# Altium project altium_v4.PrjPCB (part 2 of 2)

## Sheet Communications.SchDoc
size A
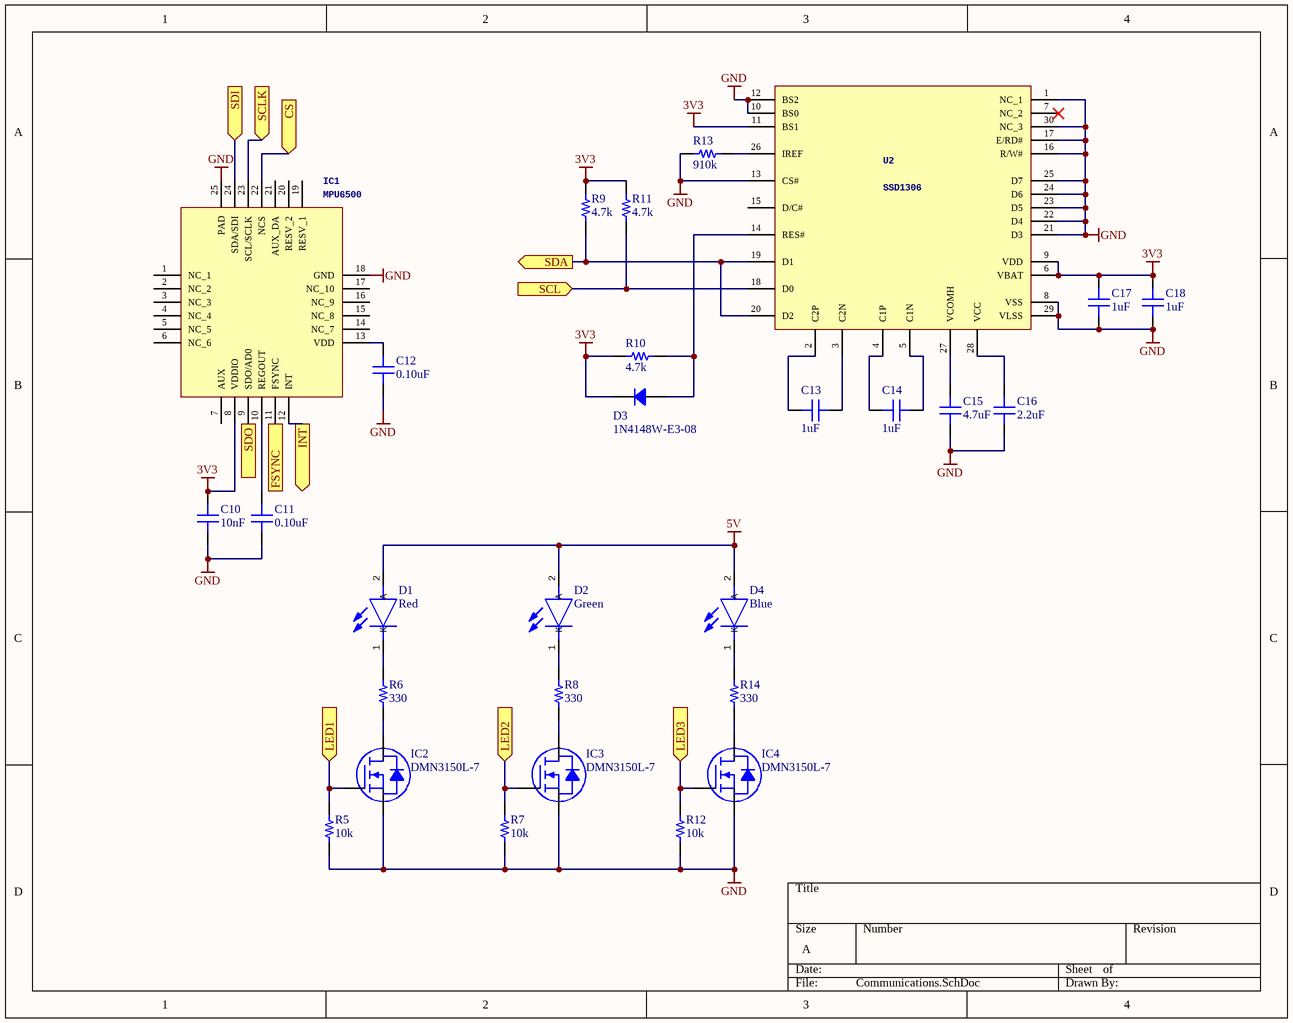
[diagram p5: Communications.SchDoc]

### Parts
C10  10nF  [CAP 0402/1005]
C11  0.10uF  [CAP 0402/1005]
C12  0.10uF  [CAP 0402/1005]
C13  1uF  [CAP 0603/1608]
C14  1uF  [CAP 0603/1608]
C15  4.7uF  [CAP 0805/2012]
C16  2.2uF  [CAP 0402/1005]
C17  1uF  [CAP 0603/1608]
C18  1uF  [CAP 0603/1608]
D1  Red  [LTST]
D2  Green  [LTST]
D3  1N4148W-E3-08  [SOD-123]
D4  Blue  [LTST]
IC1  MPU6500  [QFN40P300X300X95-25N]
IC2  DMN3150L-7  [DIODES SOT-23-3]
IC3  DMN3150L-7  [DIODES SOT-23-3]
IC4  DMN3150L-7  [DIODES SOT-23-3]
R5  10k  [RES 0402/1005]
R6  330  [RES 0402/1005]
R7  10k  [RES 0402/1005]
R8  330  [RES 0402/1005]
R9  4.7k  [RES 0603/1608]
R10  4.7k  [RES 0603/1608]
R11  4.7k  [RES 0603/1608]
R12  10k  [RES 0402/1005]
R13  910k  [RES 0402/1005]
R14  330  [RES 0402/1005]
U2  SSD1306  [30PINFPC_P0.7MM]

### Ports
CS (in), FSYNC (in), INT (out), LED1 (in), LED2 (in), LED3 (in), SCL (in), SCLK (in), SDA (out), SDI (in), SDO (out)

### Nets
3V3: C10.2 C17.2 C18.2 D3.2 IC1.8(VDDIO) R9.2 R10.2 R11.2 U2.6(VBAT) U2.9(VDD) U2.11(BS1)
5V: D1.2(A) D2.2(A) D4.2(A)
GND: C10.1 C11.1 C12.1 C15.1 C16.1 C17.1 C18.1 IC1.18(GND) IC1.25(PAD) IC2.3(S) IC3.3(S) IC4.3(S) R5.1 R7.1 R12.1 R13.1 U2.1(NC_1) U2.8(VSS) U2.10(BS0) U2.12(BS2) U2.13(CS#) U2.16(R/W#) U2.17(E/RD#) U2.21(D3) U2.22(D4) U2.23(D5) U2.24(D6) U2.25(D7) U2.29(VLSS) U2.30(NC_3)
NetC11_2: C11.2 IC1.10(REGOUT)
NetC12_2: C12.2 IC1.13(VDD)
NetC13_1: C13.1 U2.2(C2P)
NetC13_2: C13.2 U2.3(C2N)
NetC14_1: C14.1 U2.4(C1P)
NetC14_2: C14.2 U2.5(C1N)
NetC15_2: C15.2 U2.27(VCOMH)
NetC16_2: C16.2 U2.28(VCC)
NetD1_1: D1.1(K) R6.2
NetD2_1: D2.1(K) R8.2
NetD3_1: D3.1 R10.1 U2.14(RES#)
NetD4_1: D4.1(K) R14.2
NetIC1_9: IC1.9(SDO/AD0) ; port SDO
NetIC1_11: IC1.11(FSYNC) ; port FSYNC
NetIC1_12: IC1.12(INT) ; port INT
NetIC1_22: IC1.22(NCS) ; port CS
NetIC1_23: IC1.23(SCL/SCLK) ; port SCLK
NetIC1_24: IC1.24(SDA/SDI) ; port SDI
NetIC2_1: IC2.1(G) R5.2 ; port LED1
NetIC2_2: IC2.2(D) R6.1
NetIC3_1: IC3.1(G) R7.2 ; port LED2
NetIC3_2: IC3.2(D) R8.1
NetIC4_1: IC4.1(G) R12.2 ; port LED3
NetIC4_2: IC4.2(D) R14.1
NetR9_1: R9.1 U2.19(D1) U2.20(D2) ; port SDA
NetR11_1: R11.1 U2.18(D0) ; port SCL
NetR13_2: R13.2 U2.26(IREF)

Not connected (* = marked no-connect by the designer): IC1 1(NC_1) 2(NC_2) 3(NC_3) 4(NC_4) 5(NC_5) 6(NC_6) 7(AUX) 14(NC_7) 15(NC_8) 16(NC_9) 17(NC_10) 19(RESV_1) 20(RESV_2) 21(AUX_DA); U2 7(NC_2)* 15(D/C#)

### Library data of the parts
C10 = CL05B103KO5NNNC: CAP CER 10000PF 16V X7R 0402; Manufacturer: Samsung Electro-Mechanics America, Inc.; TemperatureRange: -55C ~ 125C; Tolerance: 10%; Value: 10nF; Part Number: CL05B103KO5NNNC; PartId: 12520; Supplier 1: Digi-Key; Supplier Part Number 1: 1276-1051-2-ND; ComponentLink1Description: Datasheet; ComponentLink1URL: http://www.samsungsem.com/kr/support/library/product-catalog/__icsFiles/afieldfile/2015/11/18/MLCC.pdf; ComponentLink2Description: Digi-Key Listing; ComponentLink2URL: https://www.digikey.com/product-detail/en/samsung-electro-mechanics-america-inc/CL05B103KO5NNNC/1276-1051-2-ND/3886709; TemperatureCoefficient: X7R; Voltage: 16V; Price: 0.0017; Device Package: 0402 (1005 Metric)
C11 C12 = GCM155R71C104KA55D: CAP CER 0.1UF 16V X7R 0402; Manufacturer: Murata Electronics North America; TemperatureRange: -55C ~ 125C; Tolerance: 10%; Value: 0.10uF; Part Number: GCM155R71C104KA55D; PartId: 12362; Supplier 1: Digi-Key; Supplier Part Number 1: 490-4759-2-ND; ComponentLink1Description: Datasheet; ComponentLink1URL: http://www.murata.com/~/media/webrenewal/support/library/catalog/products/capacitor/mlcc/c03e.ashx; ComponentLink2Description: Digi-Key Listing; ComponentLink2URL: https://www.digikey.com/product-detail/en/murata-electronics-north-america/GCM155R71C104KA55D/490-4759-2-ND/1641633; TemperatureCoefficient: X7R; Voltage: 16V; Price: 0.0088; Device Package: 0402 (1005 Metric)
C13 C14 C17 C18 = CL10F105ZP8NNNC: CAP CER 1UF 10V Y5V 0603; Manufacturer: Samsung Electro-Mechanics America, Inc.; TemperatureRange: -30C ~ 85C; TemperatureCoefficient: Y5V (F); Tolerance: -20%, +80%; Value: 1uF; Part Number: CL10F105ZP8NNNC; PartId: 13159; Supplier 1: Digi-Key; Supplier Part Number 1: 1276-1041-2-ND; ComponentLink1Description: Datasheet; ComponentLink1URL: http://www.samsungsem.com/kr/support/product-search/mlcc/CL10F105ZP8NNNC.jsp; ComponentLink2Description: Digi-Key Listing; ComponentLink2URL: https://www.digikey.com/product-detail/en/samsung-electro-mechanics-america-inc/CL10F105ZP8NNNC/1276-1041-2-ND/3886699; Voltage: 10V; Price: 0.006; Device Package: 0603 (1608 Metric)
C15 = CC0805ZRY5V6BB475: CAP CER 4.7UF 10V Y5V 0805; Manufacturer: Yageo; TemperatureRange: -30C ~ 85C; TemperatureCoefficient: Y5V (F); Tolerance: -20%, +80%; Value: 4.7uF; Part Number: CC0805ZRY5V6BB475; PartId: 13806; Supplier 1: Digi-Key; Supplier Part Number 1: 311-1371-2-ND; ComponentLink1Description: Datasheet; ComponentLink1URL: http://www.yageo.com/documents/recent/UPY-GPHC_Y5V_6.3V-to-50V_6.pdf; ComponentLink2Description: Digi-Key Listing; ComponentLink2URL: https://www.digikey.com/product-detail/en/yageo/CC0805ZRY5V6BB475/311-1371-2-ND/2103109; Voltage: 10V; Price: 0.0145; Device Package: 0805 (2012 Metric)
C16 = CL05A225KP5NSNC: CAP CER 2.2UF 10V X5R 0402; Manufacturer: Samsung Electro-Mechanics America, Inc.; TemperatureRange: -55C ~ 85C; Tolerance: 10%; Value: 2.2uF; Part Number: CL05A225KP5NSNC; PartId: 12898; Supplier 1: Digi-Key; Supplier Part Number 1: 1276-1108-2-ND; ComponentLink1Description: Datasheet; ComponentLink1URL: http://www.samsungsem.com/kr/support/product-search/mlcc/CL05A225KP5NSNC.jsp; ComponentLink2Description: Digi-Key Listing; ComponentLink2URL: https://www.digikey.com/product-detail/en/samsung-electro-mechanics-america-inc/CL05A225KP5NSNC/1276-1108-2-ND/3886766; TemperatureCoefficient: X5R; Voltage: 10V; Price: 0.0612; Device Package: 0402 (1005 Metric)
D1 D2 D4 = GENERIC_LED: pin to pad: 1>K 2>A
D3 = 1N4148W-E3-08: DIODE GEN PURP 75V 150MA SOD123; Manufacturer: Vishay Semiconductor Diodes Division; Type: Standard; Current Reverse Leakage @ Vr: 100uA @ 100V; Reverse Recovery Time (trr): 4ns; Voltage Forward (Vf): 1.2V @ 100mA; Part Number: 1N4148W-E3-08; PartId: 29363; Supplier 1: Digi-Key; Supplier Part Number 1: 1N4148W-E3-08CT-ND; ComponentLink1Description: Datasheet; ComponentLink1URL: http://www.vishay.com/docs/85748/1n4148w.pdf; ComponentLink2Description: Digi-Key Listing; ComponentLink2URL: https://www.digikey.com/product-detail/en/vishay-semiconductor-diodes-division/1N4148W-E3-08/1N4148W-E3-08CT-ND/3104405; Junction Operating Temperature: 150C (Max); Price: 0.23; Device Package: SOD-123; Voltage DC Reverse (Vr): 75V; Current Rectified: 150mA
IC1 = MPU-6500: MANUFACTURER_NAME: INVENSENSE; GateName_1: G$1; SymbolName_1: MPU-6500; LibraryName: micromousev2Parts; DeviceSetName: MPU-6500; Package: QFN40P300X300X95-25N; ARROW_PART_NUMBER: MPU-6500; HEIGHT: 0.95mm; MANUFACTURER_PART_NUMBER: MPU-6500
IC2-IC4 = DMN3150L-7: MOSFET N-CH 28V 3.2A SOT23-3; Manufacturer: Diodes Incorporated; Rds On (Max) at Id, Vgs: 85 mOhm @ 3.6A, 4.5V; Vgs(th) (Max) at Id: 12V; Input Capacitance (Ciss) at Vds: 305pF @ 5V; Current Continuous Drain: 3.8A (Ta); Part Number: DMN3150L-7; PartId: 29528; Supplier 1: Digi-Key; Supplier Part Number 1: DMN3150LDICT-ND; ComponentLink1Description: Datasheet; ComponentLink1URL: http://www.diodes.com/_files/datasheets/ds31126.pdf; ComponentLink2Description: Digi-Key Listing; ComponentLink2URL: https://www.digikey.com/product-detail/en/diodes-incorporated/DMN3150L-7/DMN3150LDICT-ND/1774236; Price: 0.62; Type: N-Channel; Device Package: TO-236-3, SC-59, SOT-23-3; Drain to Source Voltage (Vdss): 28V
R5 R7 R12 = RC0402JR-0710KL: RES SMD 10K OHM 5% 1/16W 0402; Manufacturer: Yageo; TemperatureRange: -55C ~ 155C; TemperatureCoefficient: 100ppm/C; PowerRating: 0.063W, 1/16W; Value: 10k; Part Number: RC0402JR-0710KL; PartId: 14464; Supplier 1: Digi-Key; Supplier Part Number 1: 311-10KJRTR-ND; ComponentLink1Description: Datasheet; ComponentLink1URL: http://www.yageo.com/documents/recent/PYu-RC_Group_51_RoHS_L_04.pdf; ComponentLink2Description: Digi-Key Listing; ComponentLink2URL: https://www.digikey.com/product-detail/en/yageo/RC0402JR-0710KL/311-10KJRTR-ND/726418; Tolerance: 5%; Price: 0.0017; Device Package: 0402 (1005 Metric)
R6 R8 R14 = RMCF0402ZT0R00: Part Number: RMCF0402JT330R; Manufacturer: Stackpole Electronics Inc.; Value: 330; PartId: 16136; ComponentLink1Description: Datasheet; ComponentLink1URL: http://www.seielect.com/Catalog/SEI-RMCF_RMCP.pdf; ComponentLink2Description: Digi-Key Listing; ComponentLink2URL: https://www.digikey.com/product-detail/en/stackpole-electronics-inc/RMCF0402ZT0R00/RMCF0402ZT0R00TR-ND/1756905; Device Package: 0402 (1005 Metric)
R9-R11 = ERJ-3EKF4701V: RES SMD 4.7K OHM 1% 1/10W 0603; Manufacturer: Panasonic Electronic Components; TemperatureRange: -55C ~ 155C; TemperatureCoefficient: 100ppm/C; PowerRating: 0.1W, 1/10W; Value: 4.7k; Part Number: ERJ-3EKF4701V; PartId: 890; Supplier 1: Digi-Key; Supplier Part Number 1: P4.70KHTR-ND; ComponentLink1Description: Datasheet; ComponentLink1URL: http://industrial.panasonic.com/www-cgi/jvcr13pz.cgi?E+PZ+3+AOA0002+ERJ3EKF4701V+7+WW; ComponentLink2Description: Digi-Key listing; ComponentLink2URL: http://digikey.com/product-detail/en/ERJ-3EKF4701V/P4.70KHTR-ND/1746419; Tolerance: 1%; Price: 0.0038; Type: Thick Film; Device Package: 0603 (1608 Metric)
R13 = ERJ-2GEJ914X: RES SMD 910K OHM 5% 1/10W 0402; Manufacturer: Panasonic Electronic Components; TemperatureRange: -55C ~ 155C; TemperatureCoefficient: 200ppm/C; PowerRating: 0.1W, 1/10W; Value: 910k; Part Number: ERJ-2GEJ914X; PartId: 11142; Supplier 1: Digi-Key; Supplier Part Number 1: P910KJTR-ND; ComponentLink1Description: Datasheet; ComponentLink1URL: http://industrial.panasonic.com/www-cgi/jvcr13pz.cgi?E+PZ+3+AOA0001+ERJ2GEJ914X+7+WW; ComponentLink2Description: Digi-Key Listing; ComponentLink2URL: https://www.digikey.com/product-detail/en/panasonic-electronic-components/ERJ-2GEJ914X/P910KJTR-ND/147090; Tolerance: 5%; Price: 0.0019; Device Package: 0402 (1005 Metric)
U2 = SSD1306: GateName_1: G$1; SymbolName_1: SSD1306; LibraryName: micromousev2Parts; DeviceSetName: SSD1306; Package: 30PINFPC_P0.7MM

## Nets that join several sheets
3V3: Motors (R15.2 R16.2 R17.2 R18.2), Power (C36.2 IC9.5), Sensors (14 pins), MCU (18 pins), Communications (11 pins)
5V: Motors (J2.3 J3.3), Power (6 pins), Sensors (15 pins), MCU (J1.4), Communications (D1.2 D2.2 D4.2)
GND: Motors (10 pins), Power (22 pins), Sensors (34 pins), MCU (17 pins), Communications (30 pins)
VBATT: Power (9 pins), MCU (R2.2)
VBOOST: Motors (6 pins), Power (5 pins)
NetIC1_9: MCU (U1.22), Communications (IC1.9)
NetIC1_11: MCU (U1.20), Communications (IC1.11)
NetIC1_12: MCU (U1.29), Communications (IC1.12)
NetIC1_22: MCU (U1.17), Communications (IC1.22)
NetIC1_23: MCU (U1.21), Communications (IC1.23)
NetIC1_24: MCU (U1.23), Communications (IC1.24)
NetIC2_1: MCU (U1.30), Communications (IC2.1 R5.2)
NetIC3_1: MCU (U1.33), Communications (IC3.1 R7.2)
NetIC4_1: MCU (U1.34), Communications (IC4.1 R12.2)
NetIC5_2: Motors (IC5.2 R15.1), MCU (U1.61)
NetIC5_4: Motors (IC5.4 R17.1), MCU (U1.62)
NetIC6_2: Motors (IC6.2 R16.1), MCU (U1.44)
NetIC6_4: Motors (IC6.4 R18.1), MCU (U1.57)
NetIC10_1: Sensors (IC10.1 R26.2), MCU (U1.2)
NetIC11_1: Sensors (IC11.1 R30.2), MCU (U1.5)
NetIC12_1: Sensors (IC12.1 R33.2), MCU (U1.41)
NetIC13_1: Sensors (IC13.1 R37.2), MCU (U1.39)
NetIC14_1: Sensors (IC14.1 R40.2), MCU (U1.40)
NetJ2_4: Motors (J2.4), MCU (U1.14)
NetJ2_5: Motors (J2.5), MCU (U1.15)
NetJ3_4: Motors (J3.4), MCU (U1.50)
NetJ3_5: Motors (J3.5), MCU (U1.55)
NetQ3_1: Sensors (Q3.1 R27.2), MCU (U1.10)
NetQ4_1: Sensors (Q4.1 R29.2), MCU (U1.9)
NetQ5_1: Sensors (Q5.1 R32.2), MCU (U1.8)
NetQ6_1: Sensors (Q6.1 R35.2), MCU (U1.16)
NetQ7_1: Sensors (Q7.1 R36.2), MCU (U1.24)
NetQ8_1: Sensors (Q8.1 R39.2), MCU (U1.25)
NetQ9_1: Sensors (Q9.1 R41.2), MCU (U1.26)
NetR9_1: MCU (U1.59), Communications (R9.1 U2.19 U2.20)
NetR11_1: MCU (U1.58), Communications (R11.1 U2.18)